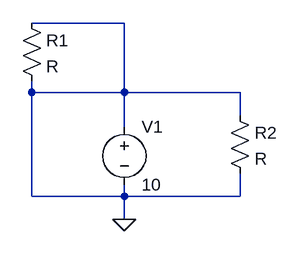
[diagram p0: schematic simple.asc]
simple.asc, the LTspice schematic file:
Version 4
SHEET 1 880 680
WIRE 256 320 128 320
WIRE 128 416 128 400
WIRE 256 416 256 320
WIRE 256 416 128 416
WIRE 416 416 256 416
WIRE 416 448 416 416
WIRE 256 464 256 416
WIRE 128 560 128 416
WIRE 256 560 256 544
WIRE 256 560 128 560
WIRE 416 560 416 528
WIRE 416 560 256 560
WIRE 256 592 256 560
FLAG 256 592 0
SYMBOL voltage 256 448 R0
SYMATTR InstName V1
SYMATTR Value 10
SYMBOL res 112 304 R0
SYMATTR InstName R1
SYMBOL res 400 432 R0
SYMATTR InstName R2

The netlist it stands for:
* simple.asc
V1 0 0 10
R1 0 0 R
R2 0 0 R
.backanno
.end